# EAGLE board rev4.1 (EAGLE 7.5.0), part 1 of 2
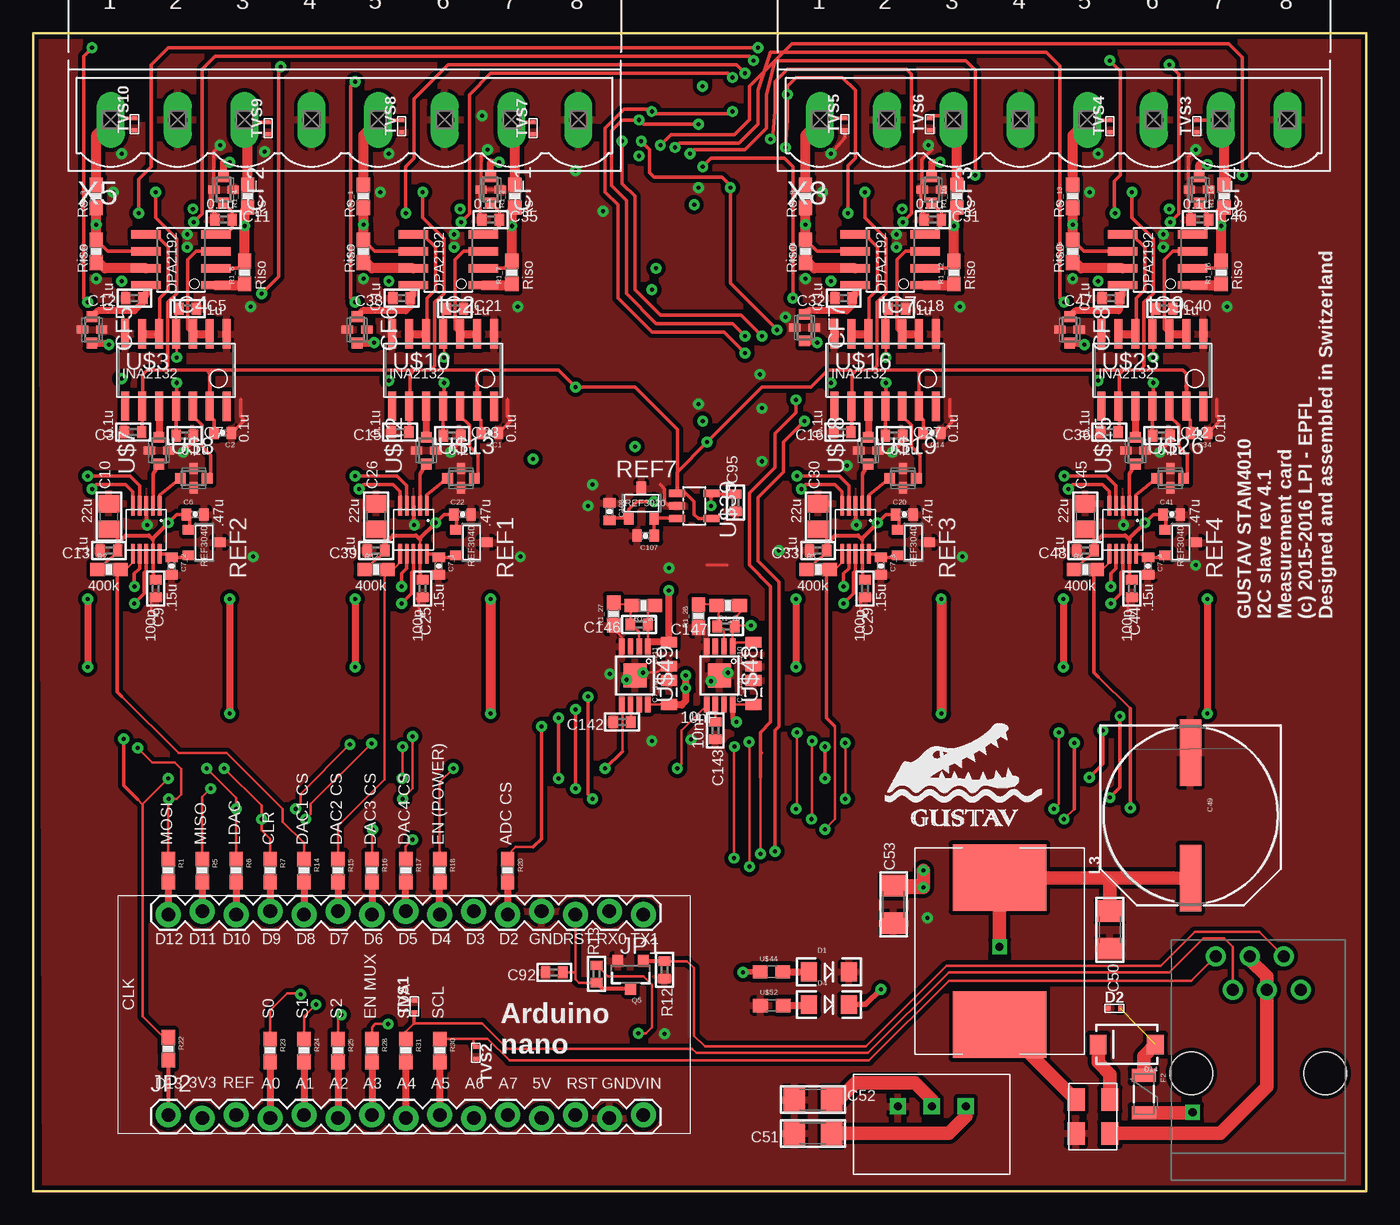
[diagram p4: board, top side]
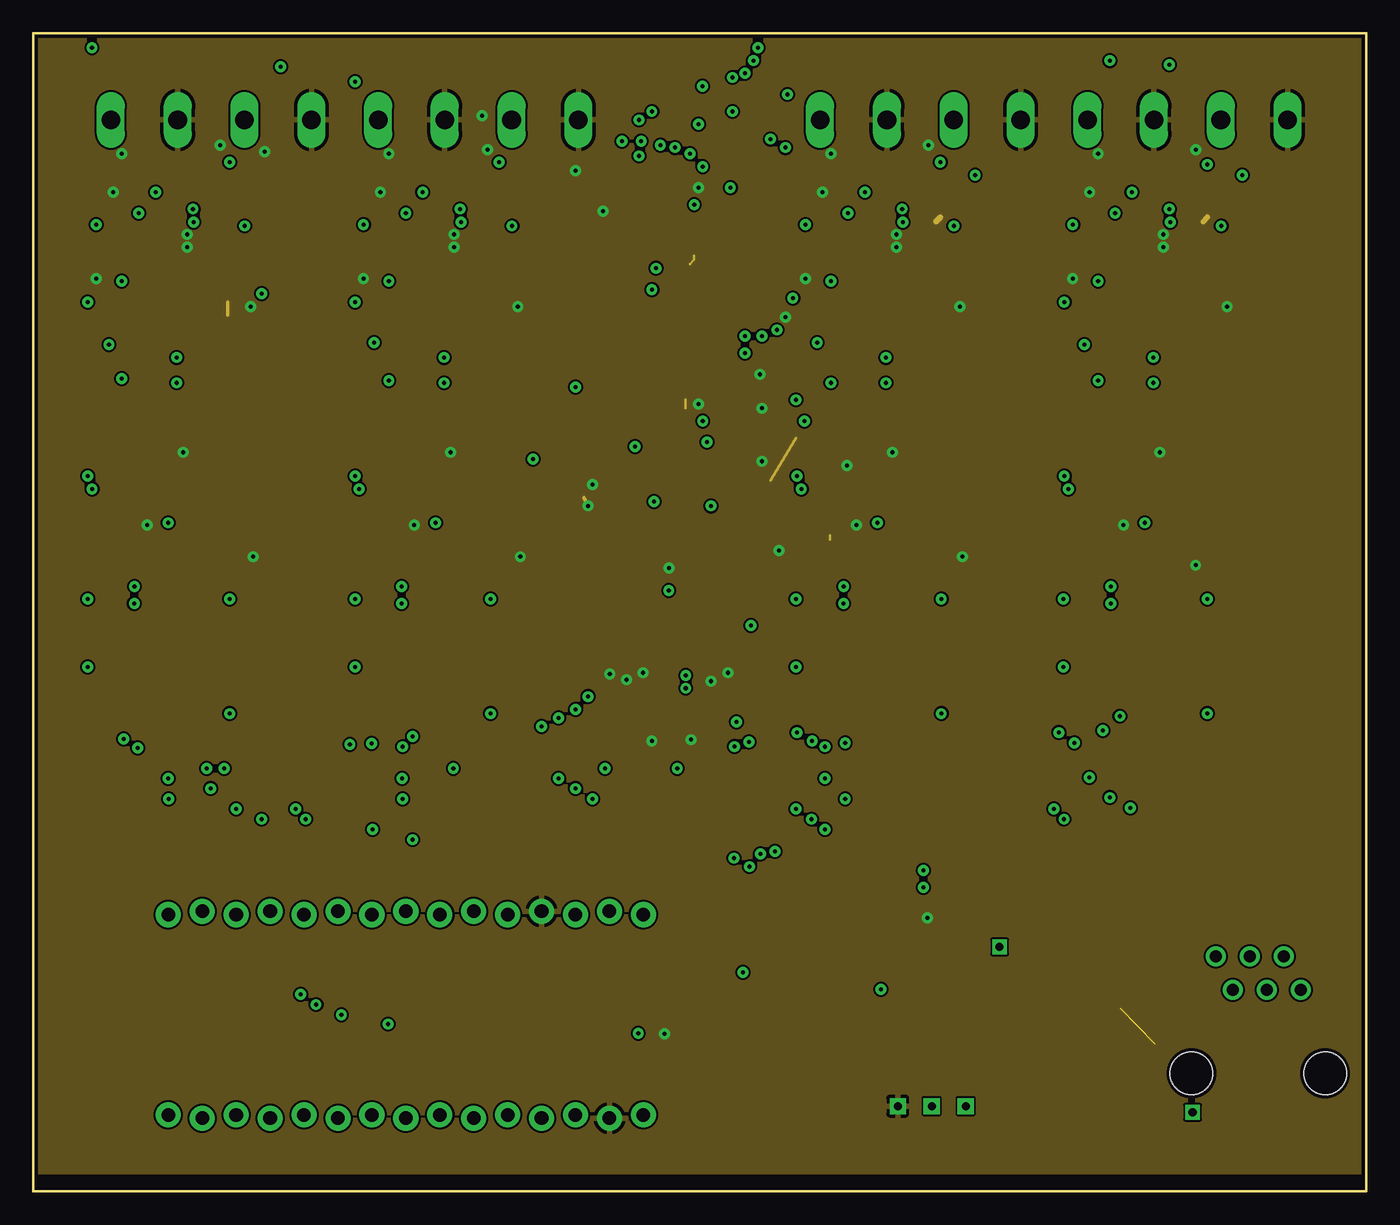
[diagram p5: board, inner layer Route2]
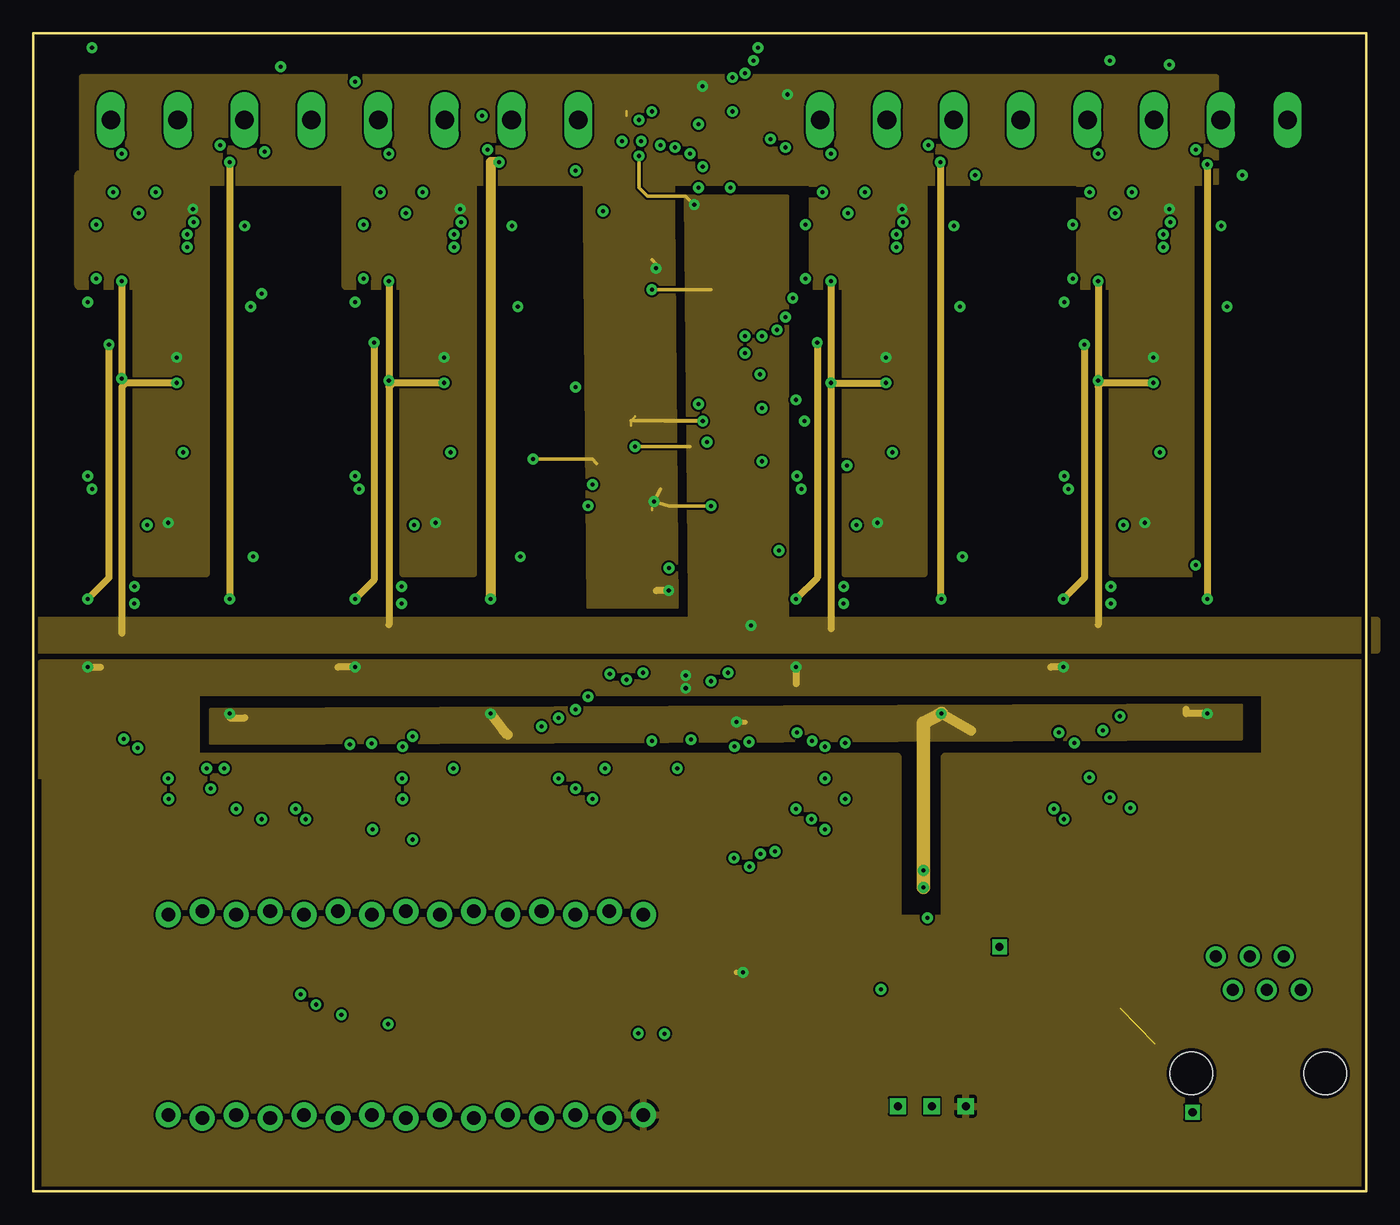
[diagram p6: board, inner layer Route15]
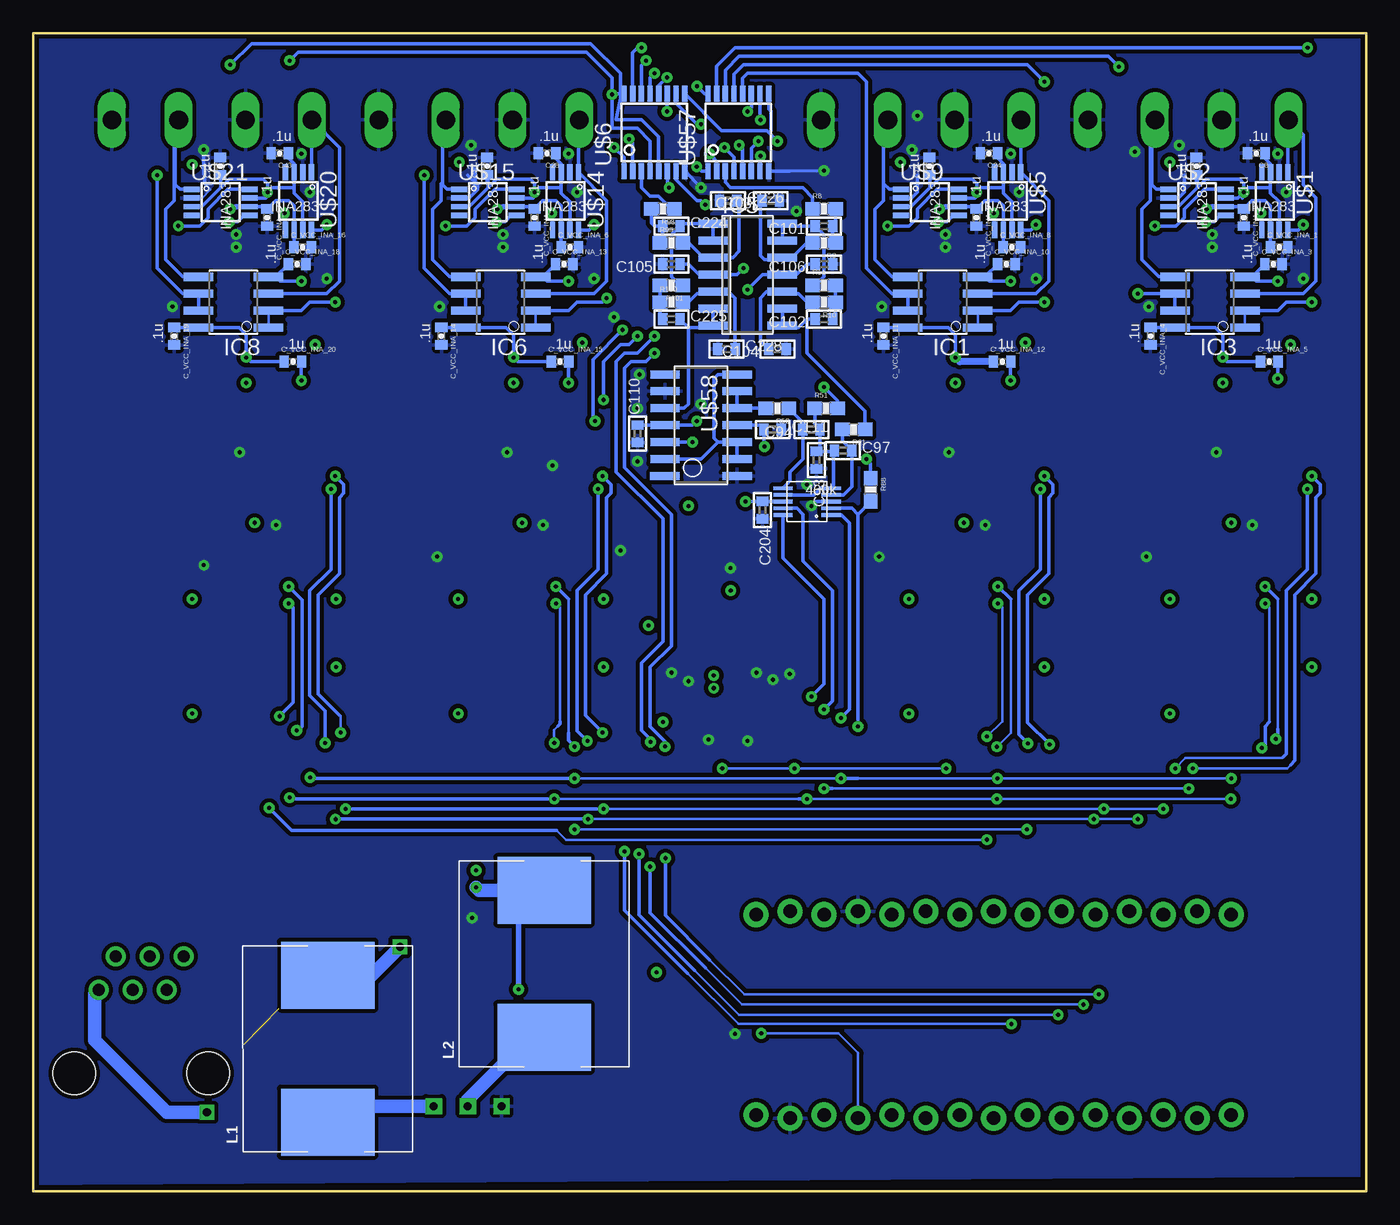
[diagram p7: board, bottom side, seen from below]

Size 99.77 x 86.68 mm. Coordinates in mm from the lower left corner, seen from the top.
Outline: 0,86.68 99.77,86.68 99.77,0 0,0 0,86.68
Copper layers ((1*2)+(15*16)): Top 0.035mm / dielectric 1.5mm / Route2 0.035mm / dielectric 0.15mm / Route15 0.035mm / dielectric 0.2mm / Bottom 0.035mm
Design rules "SparkFun *": minimum track width 8mil, minimum drill 20mil, track to track 6mil, track to pad 6mil, pad to pad 6mil, via to via 6mil, smd to smd 6mil, copper to edge 10mil, drill to drill 8mil, minimum pad ring 12mil, minimum via ring 10mil, stop-mask expansion 4mil, vias tented up to drill 25mil, thermal gap 10mil

## Footprints (pad centres in the part's own frame; a part is rotated, then mirrored left to right if it is on the bottom)
0402-CAP = smd 0.7 x 0.9: 1 -0.65,0; 2 0.65,0
0402 = smd 0.7 x 0.9: 1 -0.65,0; 2 0.65,0
0805 = smd 0.8 x 1.2: 1 -0.9,0; 2 0.9,0
0805' = smd 1.3 x 1.5: 1 -0.95,0; 2 0.95,0
PANASONIC_H13 = smd 5 x 1.6: + 4.7,0; - -4.7,0
1206 = smd 1.6 x 1.8: 1 -1.4,0; 2 1.4,0
NFM21C = smd 0.8 x 0.8: 1 -0.995,0; 3 0.995,0 | smd 0.6 x 0.846: 2@1 0,-0.723; 2@2 0,0.723
LED-1206 = smd 1.2 x 1.4: A -1.5,0; C 1.5,0
SOD-923 = smd 0.3 x 0.4: P$1 -0.45,0; P$2 0.45,0
SMA-DIODE = smd 1.27 x 1.47: A -2.15,0; C 2.15,0
PTC-1206 = smd 1 x 1.8: 1 -1.4,0; 2 1.4,0
SO08 = smd 0.61 x 2.21: 1 -1.905,-2.616; 2 -0.635,-2.616; 3 0.635,-2.616; 4 1.905,-2.616; 5 1.905,2.616; 6 0.635,2.616; 7 -0.635,2.616; 8 -1.905,2.616
SO14 = smd 0.6 x 2.2: 1 -3.81,-2.6; 2 -2.54,-2.6; 3 -1.27,-2.6; 4 0,-2.6; 5 1.27,-2.6; 6 2.54,-2.6; 7 3.81,-2.6; 8 3.81,2.6; 9 2.54,2.6; 10 1.27,2.6; 11 0,2.6; 12 -1.27,2.6; 13 -2.54,2.6; 14 -3.81,2.6
1X15_LOCK = drill 1.016 pad 1.88: 1 0,0.127; 2 2.54,-0.127; 3 5.08,0.127; 4 7.62,-0.127; 5 10.16,0.127; 6 12.7,-0.127; 7 15.24,0.127; 8 17.78,-0.127; 9 20.32,0.127; 10 22.86,-0.127; 11 25.4,0.127; 12 27.94,-0.127; 13 30.48,0.127; 14 33.02,-0.127; 15 35.56,0.127
INDUCTOR-12MM_BOURNS = smd 5 x 7: P$1 -5.5,0; P$2 5.5,0
SOT23-3 = smd 0.8 x 0.9: 1 -0.95,-1; 2 0.95,-1; 3 0,1.1
0603-RES = smd 1.1 x 1: 1 -0.85,0; 2 0.85,0
DBZ_R-PDSO-G3 = smd 0.7 x 1: 1 -0.95,-1.1; 2 0.95,-1.1; 3 0,1.1
S-PDSO-G08-NOTHERMALPAD = smd 0.4 x 1.2: 1 -0.975,-2.157; 2 -0.325,-2.157; 3 0.325,-2.157; 4 0.975,-2.157; 5 0.975,2.157; 6 0.325,2.157; 7 -0.325,2.157; 8 -0.975,2.157
SO-14 = smd 0.6 x 2.2: 1 -3.81,-2.695; 2 -2.54,-2.695; 3 -1.27,-2.695; 4 0,-2.695; 5 1.27,-2.695; 6 2.54,-2.695; 7 3.81,-2.7; 8 3.81,2.7; 9 2.54,2.7; 10 1.27,2.7; 11 0,2.7; 12 -1.27,2.7; 13 -2.54,2.7; 14 -3.81,2.7
S-PDSO-G10 = smd 0.28 x 1.45: P1 -1,-1.8; P2 -0.5,-1.8; P3 0,-1.8; P4 0.5,-1.8; P5 1,-1.8; P6 1,1.8; P7 0.5,1.8; P8 0,1.8; P9 -0.5,1.8; P10 -1,1.8
PW_R-PDSO-G16 = smd 0.4 x 1.2: 1 -2.275,-2.9; 2 -1.625,-2.9; 3 -0.975,-2.9; 4 -0.325,-2.9; 5 0.325,-2.9; 6 0.975,-2.9; 7 1.625,-2.9; 8 2.275,-2.9; 9 2.275,2.9; 10 1.625,2.9; 11 0.975,2.9; 12 0.325,2.9; 13 -0.325,2.9; 14 -0.975,2.9; 15 -1.625,2.9; 16 -2.275,2.9
2014 = smd 1.7 x 1.3: P$1 -1.27,1.27; P$2 -1.27,-1.27; P$3 1.27,-1.27; P$4 1.27,1.27
6P6C = drill 0.9: 1 -3.175,16.75; 2 -1.905,14.25; 3 -0.635,16.75; 4 0.635,14.25; 5 1.905,16.75; 6 3.175,14.25 | hole 3.2: 5,8; -5,8
SOT23-DBV = smd 0.55 x 1.2: 1 -0.95,-1.3; 2 0,-1.3; 3 0.95,-1.3; 4 0.95,1.3; 5 -0.95,1.3
TSRN1 = drill 0.6 square: P$1 -2.54,-1.35; P$2 0,-1.35; P$3 2.54,-1.35
0603 = smd 1.1 x 1: 1 -0.85,0; 2 0.85,0
S-PDSO-G08 = smd 0.4 x 1.2: 1 -0.975,-2.157; 2 -0.325,-2.157; 3 0.325,-2.157; 4 0.975,-2.157; 5 0.975,2.157; 6 0.325,2.157; 7 -0.325,2.157; 8 -0.975,2.157 | smd 1.73 x 1.78: TH 0,0
MSTBV8 = drill 1.397 long: 1 -17.501,0; 2 -12.497,0; 3 -7.493,0; 4 -2.489,0; 5 2.515,0; 6 7.493,0; 7 12.497,0; 8 17.501,0

## Placement (x,y rotation side)
C1  0.1uF  [0402-CAP]  34.18,56.77 180 top
C2  0.1uF  [0402-CAP]  14.18,56.77 180 top
C3  0.1uF  [0402]  7.46,56.83 180 top
C4  0.1uF  [0402-CAP]  12.7,76.74 90 bottom
C5  1uF  [0402]  11.55,66.06 0 top
C6  0.47uF  [0402-CAP]  12.12,50.67 0 top
C7  1uF  [0402]  11.34,56.56 0 top
C7_1  150nF  [0402-CAP]  30.35,46.8 270 top
C7_2  150nF  [0402-CAP]  10.35,46.8 270 top
C7_3  150nF  [0402-CAP]  63.45,46.8 270 top
C7_4  150nF  [0402-CAP]  83.45,46.8 270 top
C7_13  10uF  [0805]  53.92,37.34 90 top
C7_14  10uF  [0805]  47.57,37.34 90 top
C8  0.1uF  [0402-CAP]  8.22,77.69 180 bottom
C9  100pF  [0402]  9.15,45.12 270 top
C10  22uF  [0805']  5.66,50.51 90 top
C11  0.1uF  [0402]  14.23,72.74 0 top
C12  0.1uF  [0402]  7.56,66.86 180 top
C13  100nF  [0402]  5.66,47.97 180 top
C14  0.1uF  [0402-CAP]  67.27,56.77 180 top
C15  0.1uF  [0402]  27.46,56.83 180 top
C16  0.1uF  [0402]  60.55,56.83 180 top
C17  0.1uF  [0402-CAP]  65.79,76.74 90 bottom
C18  1uF  [0402]  64.65,66.06 0 top
C19  0.1uF  [0402-CAP]  32.7,76.74 90 bottom
C20  0.47uF  [0402-CAP]  65.21,50.67 0 top
C21  1uF  [0402]  31.55,66.06 0 top
C22  0.47uF  [0402-CAP]  32.12,50.67 0 top
C23  1uF  [0402]  31.34,56.56 0 top
C24  0.1uF  [0402-CAP]  28.22,77.69 180 bottom
C25  100pF  [0402]  29.15,45.12 270 top
C26  22uF  [0805']  25.66,50.51 90 top
C27  1uF  [0402]  64.43,56.56 0 top
C28  0.1uF  [0402-CAP]  61.32,77.69 180 bottom
C29  100pF  [0402]  62.25,45.12 270 top
C30  22uF  [0805']  58.75,50.51 90 top
C31  0.1uF  [0402]  67.33,72.74 0 top
C32  0.1uF  [0402]  60.66,66.86 180 top
C33  100nF  [0402]  58.75,47.97 180 top
C34  0.1uF  [0402-CAP]  87.27,56.77 180 top
C35  0.1uF  [0402]  34.23,72.74 0 top
C36  0.1uF  [0402]  80.55,56.83 180 top
C37  0.1uF  [0402-CAP]  85.79,76.74 90 bottom
C38  0.1uF  [0402]  27.56,66.86 180 top
C39  100nF  [0402]  25.66,47.97 180 top
C40  1uF  [0402]  84.65,66.06 0 top
C41  0.47uF  [0402-CAP]  85.21,50.67 0 top
C42  1uF  [0402]  84.43,56.56 0 top
C43  0.1uF  [0402-CAP]  81.32,77.69 180 bottom
C44  100pF  [0402]  82.25,45.12 270 top
C45  22uF  [0805']  78.75,50.51 90 top
C46  0.1uF  [0402]  87.33,72.74 0 top
C47  0.1uF  [0402]  80.66,66.86 180 top
C48  100nF  [0402]  78.75,47.97 180 top
C49  [PANASONIC_H13]  86.62,28.13 270 top
C50  [1206]  80.59,19.56 270 top
C51  [1206]  58.36,4.32 180 top
C52  [1206]  58.36,6.86 0 top
C53  [1206]  64.39,21.46 90 top
C92  [0402]  38.99,16.38 180 top
C93  0.1uF  [0402]  41.14,54.73 270 bottom
C94  0.1uF  [0402]  41.53,57.02 180 bottom
C95  0.1uF  [0402]  52.55,51.54 90 top
C97  0.1uF  [0402]  39.15,55.44 0 bottom
C101  120nF  [0402]  40.58,72.26 180 bottom
C102  750nF  [0402]  40.58,65.28 180 bottom
C103  100nF  [0402]  44.57,74.17 180 bottom
C104  100nF  [0402]  44.07,63.06 180 bottom
C105  120nF  [0402]  52.01,69.41 180 bottom
C106  120nF  [0402]  40.58,69.41 180 bottom
C107  0.47uF  [0402-CAP]  45.84,49.07 180 top
C108  0.47uF  [0402-CAP]  43.12,50.88 270 top
C110  120nF  [0402]  54.55,56.71 90 bottom
C111  120nF  [0402]  44.42,57 0 bottom
C142  0.1uF  [0402]  44.07,35.13 180 top
C143  0.1uF  [0402]  51.04,34.48 270 top
C146  0.1uF  [0402]  45.34,42.41 180 top
C147  0.1uF  [0402]  51.85,42.26 180 top
C204  0.1uF  [0402]  45.19,50.99 270 bottom
C210  10uF  [0805]  53.92,40.2 90 top
C211  10uF  [0805]  47.57,40.2 90 top
C224  120nF  [0402]  52.01,72.26 0 bottom
C225  750nF  [0402]  52.01,65.28 0 bottom
C226  100nF  [0402]  47.76,74.16 0 bottom
C228  100nF  [0402]  47.88,63.06 0 bottom
C_VCC_INA_1  0.1uF  [0402-CAP]  6.52,70.67 0 bottom
C_VCC_INA_2  0.1uF  [0402-CAP]  9.16,72.9 270 bottom
C_VCC_INA_3  0.1uF  [0402-CAP]  6.93,69.41 0 bottom
C_VCC_INA_4  0.1uF  [0402-CAP]  16.13,64.01 270 bottom
C_VCC_INA_5  0.1uF  [0402-CAP]  7.25,62.11 0 bottom
C_VCC_INA_6  0.1uF  [0402-CAP]  59.61,70.67 0 bottom
C_VCC_INA_7  0.1uF  [0402-CAP]  62.26,72.9 270 bottom
C_VCC_INA_8  0.1uF  [0402-CAP]  26.52,70.67 0 bottom
C_VCC_INA_9  0.1uF  [0402-CAP]  29.16,72.9 270 bottom
C_VCC_INA_10  0.1uF  [0402-CAP]  26.93,69.41 0 bottom
C_VCC_INA_11  0.1uF  [0402-CAP]  36.13,64.01 270 bottom
C_VCC_INA_12  0.1uF  [0402-CAP]  27.25,62.11 0 bottom
C_VCC_INA_13  0.1uF  [0402-CAP]  60.03,69.41 0 bottom
C_VCC_INA_14  0.1uF  [0402-CAP]  69.23,64.01 270 bottom
C_VCC_INA_15  0.1uF  [0402-CAP]  60.34,62.11 0 bottom
C_VCC_INA_16  0.1uF  [0402-CAP]  79.61,70.67 0 bottom
C_VCC_INA_17  0.1uF  [0402-CAP]  82.26,72.9 270 bottom
C_VCC_INA_18  0.1uF  [0402-CAP]  80.03,69.41 0 bottom
C_VCC_INA_19  0.1uF  [0402-CAP]  89.23,64.01 270 bottom
C_VCC_INA_20  0.1uF  [0402-CAP]  80.34,62.11 0 bottom
CF1  NFM21C  [NFM21C]  34.23,74.96 270 top
CF2  NFM21C  [NFM21C]  14.23,74.96 270 top
CF3  NFM21C  [NFM21C]  67.25,74.96 270 top
CF4  NFM21C  [NFM21C]  87.25,74.96 270 top
CF5  NFM21C  [NFM21C]  4.39,64.48 270 top
CF6  NFM21C  [NFM21C]  24.23,64.48 270 top
CF7  NFM21C  [NFM21C]  57.73,64.64 270 top
CF8  NFM21C  [NFM21C]  77.57,64.48 270 top
D1  RED  [LED-1206]  59.56,16.42 0 top
D2  [SOD-923]  80.9,13.68 0 top
D4  BLUE  [LED-1206]  59.57,13.97 0 top
D14  MBRA140  [SMA-DIODE]  81.86,10.99 180 top
F2  PTCSMD  [PTC-1206]  83.13,7.27 270 top
IC1  OPA2130U  [SO08]  31.69,66.55 90 bottom
IC2  OPA2197  [SO08]  31.06,69.72 90 top
IC3  OPA2130U  [SO08]  11.69,66.55 90 bottom
IC4  OPA2197  [SO08]  11.06,69.72 90 top
IC5  OPA4227D  [SO14]  46.3,68.61 270 bottom
IC6  OPA2130U  [SO08]  64.79,66.55 90 bottom
IC7  OPA2197  [SO08]  64.15,69.72 90 top
IC8  OPA2130U  [SO08]  84.79,66.55 90 bottom
IC9  OPA2197  [SO08]  84.15,69.72 90 top
JP1  M15LOCK  [1X15_LOCK]  45.66,20.83 180 top
JP2  M15LOCK  [1X15_LOCK]  10.1,5.59 0 top
L1  [INDUCTOR-12MM_BOURNS]  77.73,10.67 90 bottom
L2  [INDUCTOR-12MM_BOURNS]  61.54,17.02 90 bottom
L3  [INDUCTOR-12MM_BOURNS]  72.33,17.97 270 top
Q5  MOSFET-NCHANNELAO3404A  [SOT23-3]  44.71,16.26 180 top
R1  330  [0603-RES]  10.1,24 270 top
R1_1  1  [0603-RES]  24.71,74.49 90 top
R1_2  1  [0603-RES]  36.04,74.49 90 top
R1_3  1  [0603-RES]  4.71,74.49 90 top
R1_4  1  [0603-RES]  16.04,74.49 90 top
R1_5  1  [0603-RES]  24.71,70.36 90 top
R1_6  1  [0603-RES]  4.71,70.36 90 top
R1_7  1  [0603-RES]  35.82,68.77 90 top
R1_8  1  [0603-RES]  15.82,68.77 90 top
R1_9  1  [0603-RES]  57.8,74.49 90 top
R1_10  1  [0603-RES]  69.14,74.49 90 top
R1_11  1  [0603-RES]  57.8,70.36 90 top
R1_12  1  [0603-RES]  68.91,68.77 90 top
R1_13  1  [0603-RES]  77.8,74.49 90 top
R1_14  1  [0603-RES]  89.14,74.49 90 top
R1_15  1  [0603-RES]  77.8,70.36 90 top
R1_16  1  [0603-RES]  88.91,68.77 90 top
R1_25  32.4k  [0603-RES]  52.01,43.85 180 top
R1_26  32.4k  [0603-RES]  45.66,43.85 180 top
R1_27  10k  [0603-RES]  43.44,43.21 90 top
R1_28  10k  [0603-RES]  49.79,43.05 90 top
R2  400k  [0603-RES]  5.66,46.55 0 top
R3  400k  [0603-RES]  58.75,46.55 0 top
R4  400k  [0603-RES]  78.75,46.55 0 top
R5  330  [0603-RES]  12.64,24 270 top
R6  330  [0603-RES]  15.18,24 270 top
R7  330  [0603-RES]  17.72,24 270 top
R8  12.4k  [0603-RES]  40.58,73.53 0 bottom
R9  16.9k  [0603-RES]  40.58,70.99 180 bottom
R10  7.87k  [0603-RES]  40.58,66.55 180 bottom
R11  4.22k  [0603-RES]  40.58,67.82 0 bottom
R12  100k  [0402]  47.25,16.57 270 top
R13  10k  [0402]  42.17,16.26 90 top
R14  330  [0603-RES]  20.26,24 270 top
R15  330  [0603-RES]  22.8,24 270 top
R16  330  [0603-RES]  25.34,24 270 top
R17  330  [0603-RES]  27.88,24 270 top
R18  330  [0603-RES]  30.42,24 270 top
R20  330  [0603-RES]  35.5,24 270 top
R21  [0603-RES]  38.36,57.02 180 bottom
R22  330  [0603-RES]  10.1,10.67 270 top
R23  330  [0603-RES]  17.72,10.54 270 top
R24  330  [0603-RES]  20.26,10.54 270 top
R25  330  [0603-RES]  22.8,10.54 270 top
R28  330  [0603-RES]  25.34,10.54 270 top
R30  330  [0603-RES]  30.42,10.54 270 top
R31  330  [0603-RES]  27.88,10.54 270 top
R32  400k  [0603-RES]  25.66,46.55 0 top
R51  [0603-RES]  40.42,58.61 0 bottom
R52  [0603-RES]  44.07,58.61 180 bottom
R88  400k  [0603-RES]  37.09,52.52 270 bottom
R98  12.4k  [0603-RES]  52.65,73.53 180 bottom
R99  16.9k  [0603-RES]  52.01,70.99 0 bottom
R100  7.870k  [0603-RES]  52.01,66.55 0 bottom
R101  4.22k  [0603-RES]  52.01,67.82 180 bottom
REF1  REF3040  [DBZ_R-PDSO-G3]  32.79,48.57 270 top
REF2  REF3040  [DBZ_R-PDSO-G3]  12.79,48.57 270 top
REF3  REF3040  [DBZ_R-PDSO-G3]  65.89,48.57 270 top
REF4  REF3040  [DBZ_R-PDSO-G3]  85.89,48.57 270 top
REF7  REF3020  [DBZ_R-PDSO-G3]  45.51,51.51 0 top
TVS1  [SOD-923]  28.52,13.84 90 top
TVS2  [SOD-923]  33.12,10.35 270 top
TVS3  [SOD-923]  87.1,79.72 90 top
TVS4  [SOD-923]  80.59,79.72 90 top
TVS5  [SOD-923]  60.74,79.88 90 top
TVS6  [SOD-923]  67.09,79.88 90 top
TVS7  [SOD-923]  37.41,79.57 90 top
TVS8  [SOD-923]  27.56,79.72 90 top
TVS9  [SOD-923]  17.56,79.57 90 top
TVS10  [SOD-923]  7.56,79.88 90 top
U$1  INA283  [S-PDSO-G08-NOTHERMALPAD]  6.83,74.12 180 bottom
U$2  INA283  [S-PDSO-G08-NOTHERMALPAD]  12.65,74.03 270 bottom
U$3  INA2132  [SO-14]  10.67,61.47 0 top
U$4  DAC7563  [S-PDSO-G10]  8.45,49.52 180 top
U$5  INA283  [S-PDSO-G08-NOTHERMALPAD]  26.83,74.12 180 bottom
U$6  CD54HC4051  [PW_R-PDSO-G16]  53.28,79.25 0 bottom
U$7  CLC  [NFM21C]  9.41,55.44 90 top
U$8  CLC  [NFM21C]  12.01,53.37 0 top
U$9  INA283  [S-PDSO-G08-NOTHERMALPAD]  32.65,74.03 270 bottom
U$10  INA2132  [SO-14]  30.67,61.47 0 top
U$11  DAC7563  [S-PDSO-G10]  28.45,49.52 180 top
U$12  CLC  [NFM21C]  29.41,55.44 90 top
U$13  CLC  [NFM21C]  32.01,53.37 0 top
U$14  INA283  [S-PDSO-G08-NOTHERMALPAD]  59.93,74.12 180 bottom
U$15  INA283  [S-PDSO-G08-NOTHERMALPAD]  65.75,74.03 270 bottom
U$16  INA2132  [SO-14]  63.77,61.47 0 top
U$17  DAC7563  [S-PDSO-G10]  61.55,49.52 180 top
U$18  CLC  [NFM21C]  62.5,55.44 90 top
U$19  CLC  [NFM21C]  65.1,53.37 0 top
U$20  INA283  [S-PDSO-G08-NOTHERMALPAD]  79.93,74.12 180 bottom
U$21  INA283  [S-PDSO-G08-NOTHERMALPAD]  85.75,74.03 270 bottom
U$22  COMMONMODEFILTER2014  [2014]  79.32,5.59 270 top
U$23  INA2132  [SO-14]  83.77,61.47 0 top
U$24  DAC7563  [S-PDSO-G10]  81.55,49.52 180 top
U$25  CLC  [NFM21C]  82.5,55.44 90 top
U$26  CLC  [NFM21C]  85.1,53.37 0 top
U$27  6P6C  [6P6C]  91.7,0.83 0 top
U$39  LMP2021  [SOT23-DBV]  49.47,51.31 270 top
U$40  ADS1018  [S-PDSO-G10]  41.85,51.63 90 bottom
U$41  [LOGO_TEXT]  63.76,26.54 0 top
U$42  TSRN1  [TSRN1]  67.25,5.02 180 top
U$44  5k  [0603]  55.26,16.42 0 top
U$48  TPS7A30  [S-PDSO-G08]  51.38,38.61 180 top
U$49  TPS7A30  [S-PDSO-G08]  45.03,38.61 180 top
U$52  3k  [0603]  55.28,13.91 0 top
U$57  CD54HC4051  [PW_R-PDSO-G16]  47,79.25 0 bottom
U$58  INA2132  [SO-14]  49.79,57.34 270 bottom
X5  [MSTBV8]  23.3,80.2 0 top
X8  [MSTBV8]  76.4,80.2 0 top